# EAGLE schematic HUZZAH_ESP8266 (EAGLE 7.7.0)
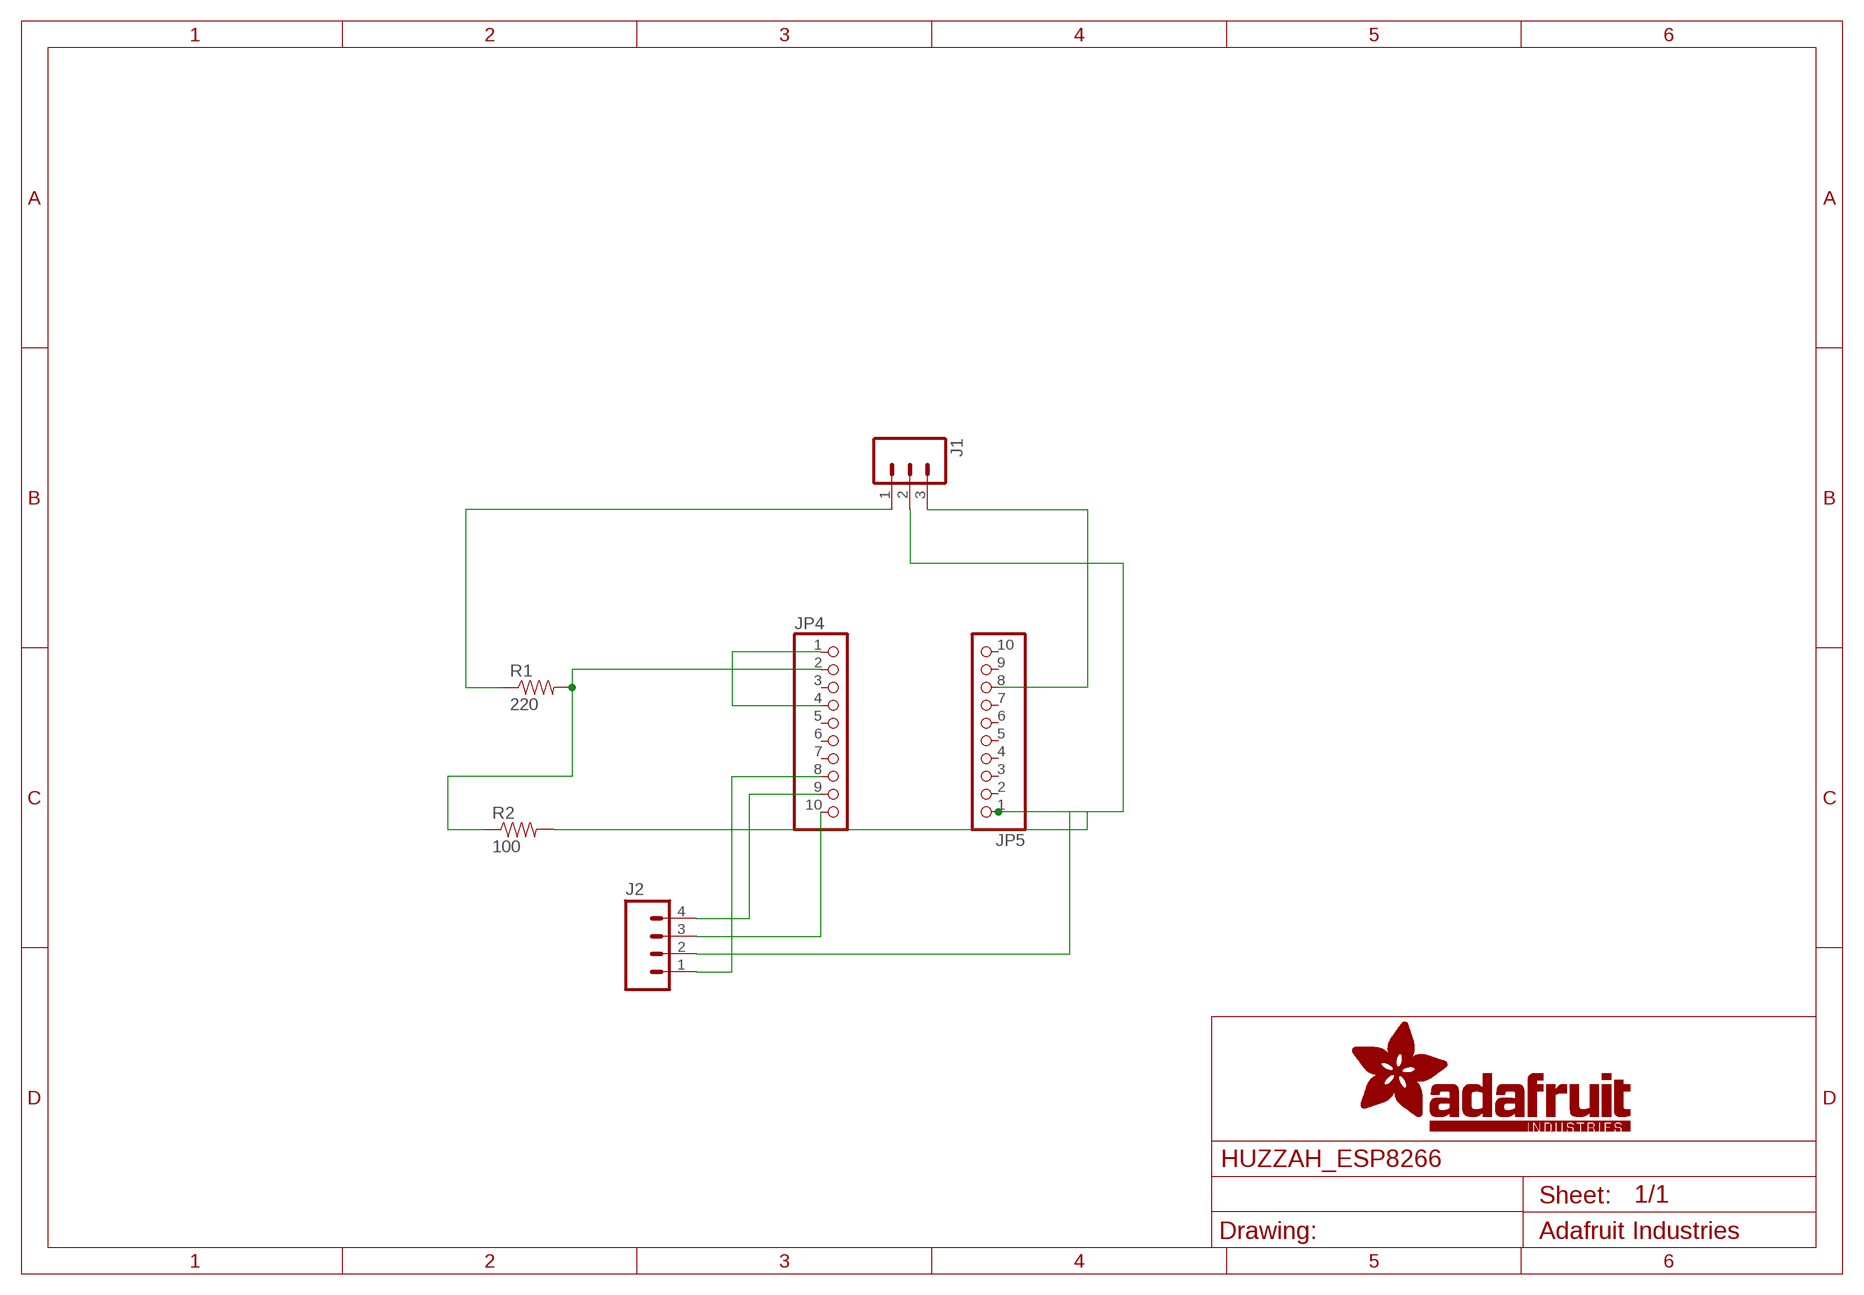
[diagram p0: schematic, sheet 1]

## Parts
J1  M031X03_NO_SILK  [1X03_NO_SILK]
J2  M041X04_NO_SILK  [1X04_NO_SILK]
JP4  HEADER-1X1070MIL  [1X10_ROUND70]
JP5  HEADER-1X1070MIL  [1X10_ROUND70]
R1  220  100OHM-1/4W-1%(PTH)  [AXIAL-0.3]
R2  100  100OHM-1/4W-1%(PTH)  [AXIAL-0.3]

## Nets
N$1: J1.3 JP5.8
N$2: J1.2 J2.2 JP5.1 R2.P$2
N$3: JP4.1 JP4.4
N$4: JP4.2 R1.P$2 R2.P$1
N$5: J2.4 JP4.9
N$6: J1.1 R1.P$1
N$7: J2.1 JP4.8
N$8: J2.3 JP4.10
Unconnected: JP4.3 JP4.5 JP4.6 JP4.7 JP5.2 JP5.3 JP5.4 JP5.5 JP5.6 JP5.7 JP5.9 JP5.10

## Library data of the parts
J1 = SparkFun-Connectors:M03: Header 3 Standard 3-pin 0.1" header. Use with straight break away headers (SKU : PRT-00116), right angle break away headers (PRT-00553), swiss pins (PRT-00743), machine pins (PRT-00117), and female headers (PRT-00115). Molex polarized connector foot print use with SKU : PRT-08232 with associated crimp pins and housings.
J2 = SparkFun-Connectors:M04: Header 4 Standard 4-pin 0.1" header. Use with straight break away headers (SKU : PRT-00116), right angle break away headers (PRT-00553), swiss pins (PRT-00743), machine pins (PRT-00117), and female headers (PRT-00115). Molex polarized connector foot print use with SKU : PRT-08231 with associated crimp pins and housings. 1MM SMD Version SKU: PRT-10208; PROD_ID: CONN-09696
JP4 JP5 = microbuilder:HEADER-1X10: PIN HEADER
R1 = SparkFun-Resistors:100OHM-1/4W-1%(PTH): RES-12181; PROD_ID: RES-12181; VALUE: 100
R2 = SparkFun-Resistors:100OHM-1/4W-1%(PTH): RES-12181; PROD_ID: RES-12181